# EAGLE schematic Control_Logic_V2 (EAGLE 9.6.2)
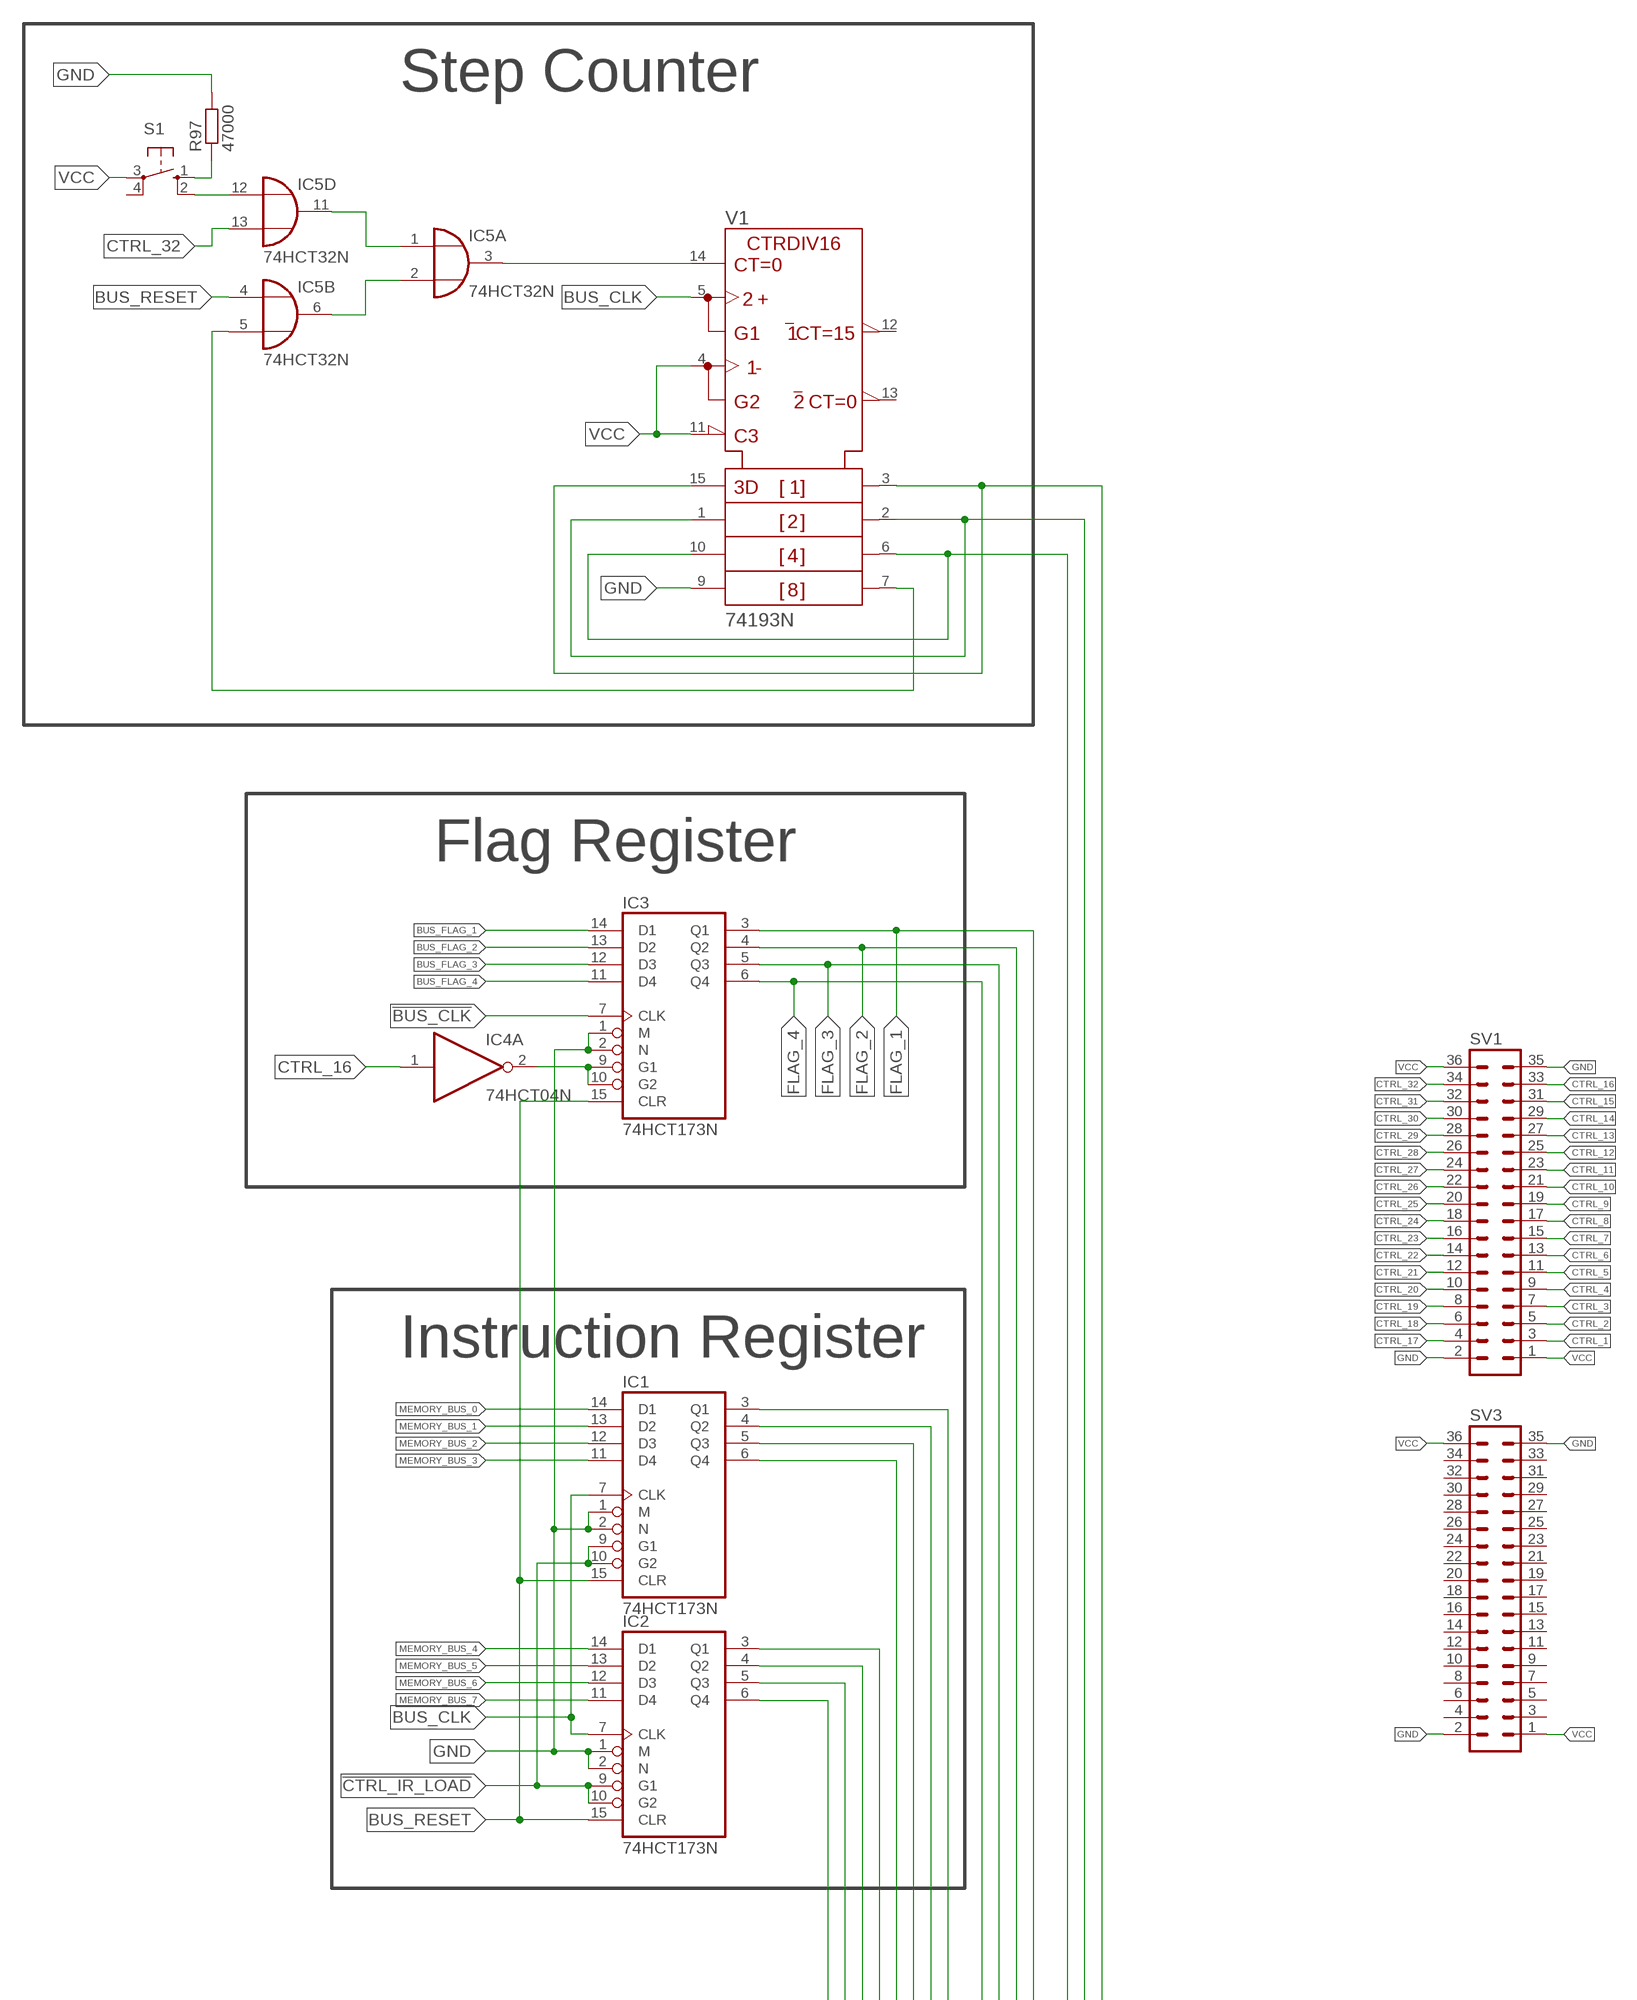
[diagram p0: schematic, sheet 1, part 1 of 3]
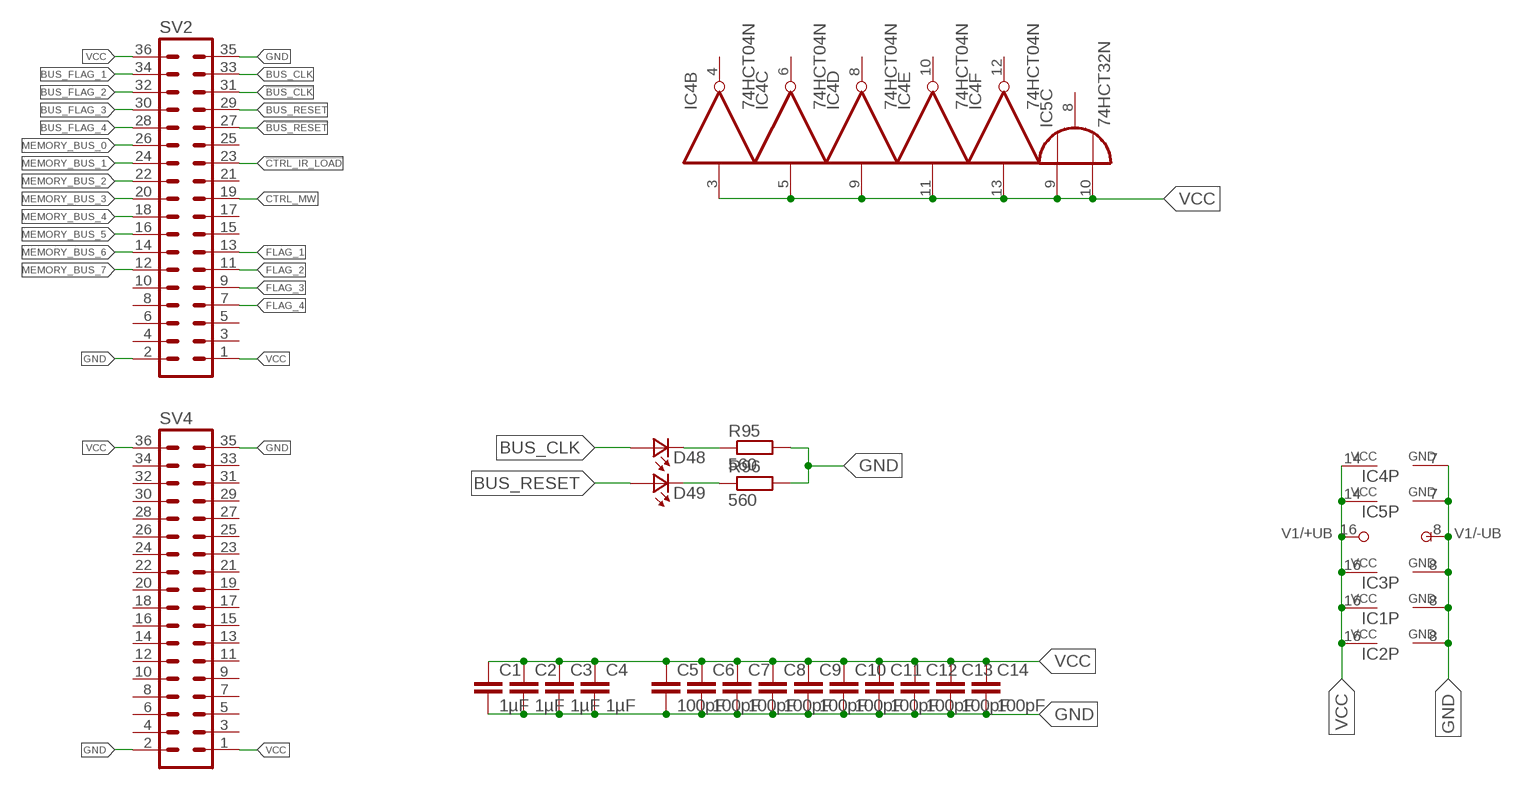
[diagram p1: schematic, sheet 1, part 2 of 3]
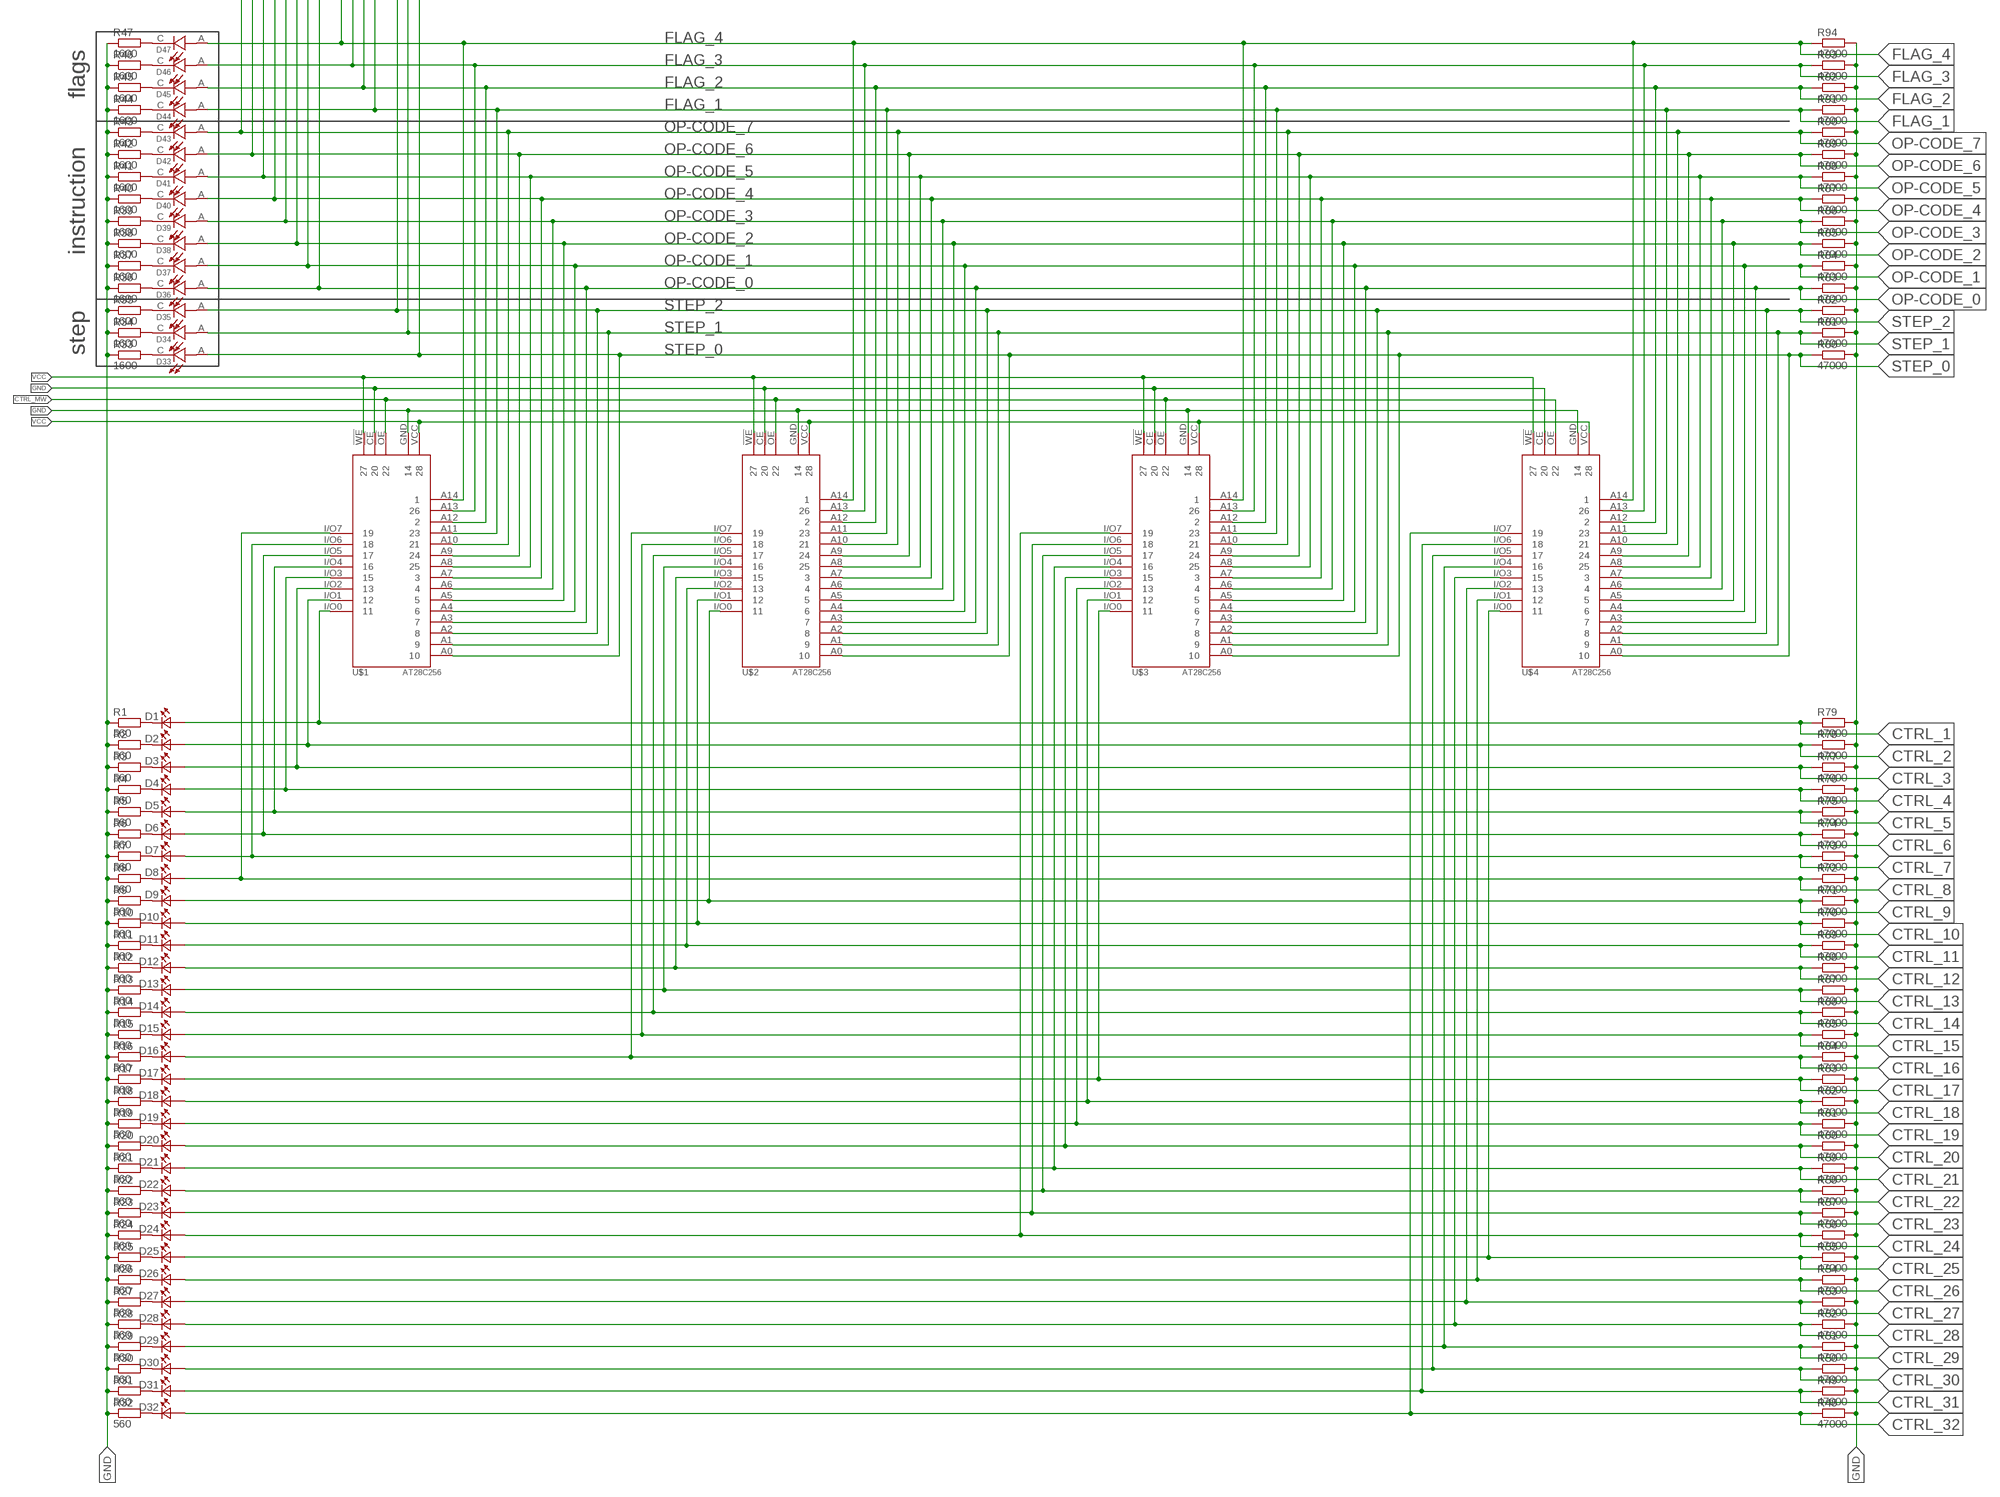
[diagram p2: schematic, sheet 1, part 3 of 3]

## Parts
C1  1µF  C-EUC0805  [C0805]
C2  1µF  C-EUC0805  [C0805]
C3  1µF  C-EUC0805  [C0805]
C4  1µF  C-EUC0805  [C0805]
C5  100pF  C-EUC0805  [C0805]
C6  100pF  C-EUC0805  [C0805]
C7  100pF  C-EUC0805  [C0805]
C8  100pF  C-EUC0805  [C0805]
C9  100pF  C-EUC0805  [C0805]
C10  100pF  C-EUC0805  [C0805]
C11  100pF  C-EUC0805  [C0805]
C12  100pF  C-EUC0805  [C0805]
C13  100pF  C-EUC0805  [C0805]
C14  100pF  C-EUC0805  [C0805]
D1  LTST-C193TBKT-5A  [0603]
D2  LTST-C193TBKT-5A  [0603]
D3  LTST-C193TBKT-5A  [0603]
D4  LTST-C193TBKT-5A  [0603]
D5  LTST-C193TBKT-5A  [0603]
D6  LTST-C193TBKT-5A  [0603]
D7  LTST-C193TBKT-5A  [0603]
D8  LTST-C193TBKT-5A  [0603]
D9  LTST-C193TBKT-5A  [0603]
D10  LTST-C193TBKT-5A  [0603]
D11  LTST-C193TBKT-5A  [0603]
D12  LTST-C193TBKT-5A  [0603]
D13  LTST-C193TBKT-5A  [0603]
D14  LTST-C193TBKT-5A  [0603]
D15  LTST-C193TBKT-5A  [0603]
D16  LTST-C193TBKT-5A  [0603]
D17  LTST-C193TBKT-5A  [0603]
D18  LTST-C193TBKT-5A  [0603]
D19  LTST-C193TBKT-5A  [0603]
D20  LTST-C193TBKT-5A  [0603]
D21  LTST-C193TBKT-5A  [0603]
D22  LTST-C193TBKT-5A  [0603]
D23  LTST-C193TBKT-5A  [0603]
D24  LTST-C193TBKT-5A  [0603]
D25  LTST-C193TBKT-5A  [0603]
D26  LTST-C193TBKT-5A  [0603]
D27  LTST-C193TBKT-5A  [0603]
D28  LTST-C193TBKT-5A  [0603]
D29  LTST-C193TBKT-5A  [0603]
D30  LTST-C193TBKT-5A  [0603]
D31  LTST-C193TBKT-5A  [0603]
D32  LTST-C193TBKT-5A  [0603]
D33  LTST-C193KRKT-5A  [LEDC1608X45N]
D34  LTST-C193KRKT-5A  [LEDC1608X45N]
D35  LTST-C193KRKT-5A  [LEDC1608X45N]
D36  LTST-C193KRKT-5A  [LEDC1608X45N]
D37  LTST-C193KRKT-5A  [LEDC1608X45N]
D38  LTST-C193KRKT-5A  [LEDC1608X45N]
D39  LTST-C193KRKT-5A  [LEDC1608X45N]
D40  LTST-C193KRKT-5A  [LEDC1608X45N]
D41  LTST-C193KRKT-5A  [LEDC1608X45N]
D42  LTST-C193KRKT-5A  [LEDC1608X45N]
D43  LTST-C193KRKT-5A  [LEDC1608X45N]
D44  LTST-C193KRKT-5A  [LEDC1608X45N]
D45  LTST-C193KRKT-5A  [LEDC1608X45N]
D46  LTST-C193KRKT-5A  [LEDC1608X45N]
D47  LTST-C193KRKT-5A  [LEDC1608X45N]
D48  LTST-C193TBKT-5A  [0603]
D49  LTST-C193TBKT-5A  [0603]
IC1  74HCT173N  [DIL16]
IC2  74HCT173N  [DIL16]
IC3  74HCT173N  [DIL16]
IC4  74HCT04N  [DIL14]
IC5  74HCT32N  [DIL14]
R1  560  R-EU_R0805  [R0805]
R2  560  R-EU_R0805  [R0805]
R3  560  R-EU_R0805  [R0805]
R4  560  R-EU_R0805  [R0805]
R5  560  R-EU_R0805  [R0805]
R6  560  R-EU_R0805  [R0805]
R7  560  R-EU_R0805  [R0805]
R8  560  R-EU_R0805  [R0805]
R9  560  R-EU_R0805  [R0805]
R10  560  R-EU_R0805  [R0805]
R11  560  R-EU_R0805  [R0805]
R12  560  R-EU_R0805  [R0805]
R13  560  R-EU_R0805  [R0805]
R14  560  R-EU_R0805  [R0805]
R15  560  R-EU_R0805  [R0805]
R16  560  R-EU_R0805  [R0805]
R17  560  R-EU_R0805  [R0805]
R18  560  R-EU_R0805  [R0805]
R19  560  R-EU_R0805  [R0805]
R20  560  R-EU_R0805  [R0805]
R21  560  R-EU_R0805  [R0805]
R22  560  R-EU_R0805  [R0805]
R23  560  R-EU_R0805  [R0805]
R24  560  R-EU_R0805  [R0805]
R25  560  R-EU_R0805  [R0805]
R26  560  R-EU_R0805  [R0805]
R27  560  R-EU_R0805  [R0805]
R28  560  R-EU_R0805  [R0805]
R29  560  R-EU_R0805  [R0805]
R30  560  R-EU_R0805  [R0805]
R31  560  R-EU_R0805  [R0805]
R32  560  R-EU_R0805  [R0805]
R33  1600  R-EU_R0805  [R0805]
R34  1600  R-EU_R0805  [R0805]
R35  1600  R-EU_R0805  [R0805]
R36  1600  R-EU_R0805  [R0805]
R37  1600  R-EU_R0805  [R0805]
R38  1600  R-EU_R0805  [R0805]
R39  1600  R-EU_R0805  [R0805]
R40  1600  R-EU_R0805  [R0805]
R41  1600  R-EU_R0805  [R0805]
R42  1600  R-EU_R0805  [R0805]
R43  1600  R-EU_R0805  [R0805]
R44  1600  R-EU_R0805  [R0805]
R45  1600  R-EU_R0805  [R0805]
R46  1600  R-EU_R0805  [R0805]
R47  1600  R-EU_R0805  [R0805]
R48  47000  R-EU_R0805  [R0805]
R49  47000  R-EU_R0805  [R0805]
R50  47000  R-EU_R0805  [R0805]
R51  47000  R-EU_R0805  [R0805]
R52  47000  R-EU_R0805  [R0805]
R53  47000  R-EU_R0805  [R0805]
R54  47000  R-EU_R0805  [R0805]
R55  47000  R-EU_R0805  [R0805]
R56  47000  R-EU_R0805  [R0805]
R57  47000  R-EU_R0805  [R0805]
R58  47000  R-EU_R0805  [R0805]
R59  47000  R-EU_R0805  [R0805]
R60  47000  R-EU_R0805  [R0805]
R61  47000  R-EU_R0805  [R0805]
R62  47000  R-EU_R0805  [R0805]
R63  47000  R-EU_R0805  [R0805]
R64  47000  R-EU_R0805  [R0805]
R65  47000  R-EU_R0805  [R0805]
R66  47000  R-EU_R0805  [R0805]
R67  47000  R-EU_R0805  [R0805]
R68  47000  R-EU_R0805  [R0805]
R69  47000  R-EU_R0805  [R0805]
R70  47000  R-EU_R0805  [R0805]
R71  47000  R-EU_R0805  [R0805]
R72  47000  R-EU_R0805  [R0805]
R73  47000  R-EU_R0805  [R0805]
R74  47000  R-EU_R0805  [R0805]
R75  47000  R-EU_R0805  [R0805]
R76  47000  R-EU_R0805  [R0805]
R77  47000  R-EU_R0805  [R0805]
R78  47000  R-EU_R0805  [R0805]
R79  47000  R-EU_R0805  [R0805]
R80  47000  R-EU_R0805  [R0805]
R81  47000  R-EU_R0805  [R0805]
R82  47000  R-EU_R0805  [R0805]
R83  47000  R-EU_R0805  [R0805]
R84  47000  R-EU_R0805  [R0805]
R85  47000  R-EU_R0805  [R0805]
R86  47000  R-EU_R0805  [R0805]
R87  47000  R-EU_R0805  [R0805]
R88  47000  R-EU_R0805  [R0805]
R89  47000  R-EU_R0805  [R0805]
R90  47000  R-EU_R0805  [R0805]
R91  47000  R-EU_R0805  [R0805]
R92  47000  R-EU_R0805  [R0805]
R93  47000  R-EU_R0805  [R0805]
R94  47000  R-EU_R0805  [R0805]
R95  560  R-EU_R0805  [R0805]
R96  560  R-EU_R0805  [R0805]
R97  47000  R-EU_R0805  [R0805]
S1  10-XX  [B3F-10XX]
SV1  MA18-2  [MA18-2]
SV2  MA18-2  [MA18-2]
SV3  MA18-2  [MA18-2]
SV4  MA18-2  [MA18-2]
U$1  AT28C256  [AT28C256]
U$2  AT28C256  [AT28C256]
U$3  AT28C256  [AT28C256]
U$4  AT28C256  [AT28C256]
V1  74193N  [DIL16]

## Nets
!BUS_CLK: IC3.7(CLK) SV2.31
!BUS_RESET: SV2.27
!CTRL_IR_LOAD: IC1.9(G1) IC1.10(G2) IC2.9(G1) IC2.10(G2) SV2.23
BUS_CLK: D48.2(A2) IC1.7(CLK) IC2.7(CLK) SV2.33 V1.5(UP)
BUS_FLAG_1: IC3.14(D1) SV2.34
BUS_FLAG_2: IC3.13(D2) SV2.32
BUS_FLAG_3: IC3.12(D3) SV2.30
BUS_FLAG_4: IC3.11(D4) SV2.28
BUS_RESET: D49.2(A2) IC1.15(CLR) IC2.15(CLR) IC3.15(CLR) IC5.4(B:I0) SV2.29
CTRL_1: D1.2(A2) R79.1 SV1.3 U$1.I/O0
CTRL_2: D2.2(A2) R78.1 SV1.5 U$1.I/O1
CTRL_3: D3.2(A2) R77.1 SV1.7 U$1.I/O2
CTRL_4: D4.2(A2) R76.1 SV1.9 U$1.I/O3
CTRL_5: D5.2(A2) R75.1 SV1.11 U$1.I/O4
CTRL_6: D6.2(A2) R74.1 SV1.13 U$1.I/O5
CTRL_7: D7.2(A2) R73.1 SV1.15 U$1.I/O6
CTRL_8: D8.2(A2) R72.1 SV1.17 U$1.I/O7
CTRL_9: D9.2(A2) R71.1 SV1.19 U$2.I/O0
CTRL_10: D10.2(A2) R70.1 SV1.21 U$2.I/O1
CTRL_11: D11.2(A2) R69.1 SV1.23 U$2.I/O2
CTRL_12: D12.2(A2) R68.1 SV1.25 U$2.I/O3
CTRL_13: D13.2(A2) R67.1 SV1.27 U$2.I/O4
CTRL_14: D14.2(A2) R66.1 SV1.29 U$2.I/O5
CTRL_15: D15.2(A2) R65.1 SV1.31 U$2.I/O6
CTRL_16: D16.2(A2) IC4.1(A:I) R64.1 SV1.33 U$2.I/O7
CTRL_17: D17.2(A2) R63.1 SV1.4 U$3.I/O0
CTRL_18: D18.2(A2) R62.1 SV1.6 U$3.I/O1
CTRL_19: D19.2(A2) R61.1 SV1.8 U$3.I/O2
CTRL_20: D20.2(A2) R60.1 SV1.10 U$3.I/O3
CTRL_21: D21.2(A2) R59.1 SV1.12 U$3.I/O4
CTRL_22: D22.2(A2) R58.1 SV1.14 U$3.I/O5
CTRL_23: D23.2(A2) R57.1 SV1.16 U$3.I/O6
CTRL_24: D24.2(A2) R56.1 SV1.18 U$3.I/O7
CTRL_25: D25.2(A2) R55.1 SV1.20 U$4.I/O0
CTRL_26: D26.2(A2) R54.1 SV1.22 U$4.I/O1
CTRL_27: D27.2(A2) R53.1 SV1.24 U$4.I/O2
CTRL_28: D28.2(A2) R52.1 SV1.26 U$4.I/O3
CTRL_29: D29.2(A2) R51.1 SV1.28 U$4.I/O4
CTRL_30: D30.2(A2) R50.1 SV1.30 U$4.I/O5
CTRL_31: D31.2(A2) R49.1 SV1.32 U$4.I/O6
CTRL_32: D32.2(A2) IC5.13(D:I1) R48.1 SV1.34 U$4.I/O7
CTRL_MW: SV2.19 U$1.!OE U$2.!OE U$3.!OE U$4.!OE
FLAG_1: D44.A IC3.3(Q1) R91.1 SV2.13 U$1.A11 U$2.A11 U$3.A11 U$4.A11
FLAG_2: D45.A IC3.4(Q2) R92.1 SV2.11 U$1.A12 U$2.A12 U$3.A12 U$4.A12
FLAG_3: D46.A IC3.5(Q3) R93.1 SV2.9 U$1.A13 U$2.A13 U$3.A13 U$4.A13
FLAG_4: D47.A IC3.6(Q4) R94.1 SV2.7 U$1.A14 U$2.A14 U$3.A14 U$4.A14
GND: C1.2 C2.2 C3.2 C4.2 C5.2 C6.2 C7.2 C8.2 C9.2 C10.2 C11.2 C12.2 C13.2 C14.2 IC1.1(M) IC1.2(N) IC1.8(GND) IC2.1(M) IC2.2(N) IC2.8(GND) IC3.1(M) IC3.2(N) IC3.8(GND) IC4.7(P:GND) IC5.7(P:GND) R1.1 R2.1 R3.1 R4.1 R5.1 R6.1 R7.1 R8.1 R9.1 R10.1 R11.1 R12.1 R13.1 R14.1 R15.1 R16.1 R17.1 R18.1 R19.1 R20.1 R21.1 R22.1 R23.1 R24.1 R25.1 R26.1 R27.1 R28.1 R29.1 R30.1 R31.1 R32.1 R33.1 R34.1 R35.1 R36.1 R37.1 R38.1 R39.1 R40.1 R41.1 R42.1 R43.1 R44.1 R45.1 R46.1 R47.1 R48.2 R49.2 R50.2 R51.2 R52.2 R53.2 R54.2 R55.2 R56.2 R57.2 R58.2 R59.2 R60.2 R61.2 R62.2 R63.2 R64.2 R65.2 R66.2 R67.2 R68.2 R69.2 R70.2 R71.2 R72.2 R73.2 R74.2 R75.2 R76.2 R77.2 R78.2 R79.2 R80.2 R81.2 R82.2 R83.2 R84.2 R85.2 R86.2 R87.2 R88.2 R89.2 R90.2 R91.2 R92.2 R93.2 R94.2 R95.2 R96.2 R97.2 SV1.2 SV1.35 SV2.2 SV2.35 SV3.2 SV3.35 SV4.2 SV4.35 U$1.!CE U$1.GND U$2.!CE U$2.GND U$3.!CE U$3.GND U$4.!CE U$4.GND V1.8(-UB) V1.9(D)
MEMORY_BUS_0: IC1.14(D1) SV2.26
MEMORY_BUS_1: IC1.13(D2) SV2.24
MEMORY_BUS_2: IC1.12(D3) SV2.22
MEMORY_BUS_3: IC1.11(D4) SV2.20
MEMORY_BUS_4: IC2.14(D1) SV2.18
MEMORY_BUS_5: IC2.13(D2) SV2.16
MEMORY_BUS_6: IC2.12(D3) SV2.14
MEMORY_BUS_7: IC2.11(D4) SV2.12
N$1: IC3.9(G1) IC3.10(G2) IC4.2(A:O)
N$2: IC5.1(A:I0) IC5.11(D:O)
N$3: IC5.2(A:I1) IC5.6(B:O)
N$4: IC5.3(A:O) V1.14(CLR)
N$5: IC5.12(D:I0) S1.2(S1)
N$6: R97.1 S1.1(S)
N$7: IC5.5(B:I1) V1.7(QD)
N$8: D48.1(K2) R95.1
N$9: D49.1(K2) R96.1
N$32: D1.1(K2) R1.2
N$33: D2.1(K2) R2.2
N$34: D3.1(K2) R3.2
N$35: D4.1(K2) R4.2
N$36: D5.1(K2) R5.2
N$37: D6.1(K2) R6.2
N$38: D7.1(K2) R7.2
N$39: D8.1(K2) R8.2
N$40: D9.1(K2) R9.2
N$41: D10.1(K2) R10.2
N$42: D11.1(K2) R11.2
N$43: D12.1(K2) R12.2
N$44: D13.1(K2) R13.2
N$45: D14.1(K2) R14.2
N$46: D15.1(K2) R15.2
N$47: D16.1(K2) R16.2
N$48: D17.1(K2) R17.2
N$49: D18.1(K2) R18.2
N$50: D19.1(K2) R19.2
N$51: D20.1(K2) R20.2
N$52: D21.1(K2) R21.2
N$53: D22.1(K2) R22.2
N$54: D23.1(K2) R23.2
N$55: D24.1(K2) R24.2
N$56: D25.1(K2) R25.2
N$57: D26.1(K2) R26.2
N$58: D27.1(K2) R27.2
N$59: D28.1(K2) R28.2
N$60: D29.1(K2) R29.2
N$61: D30.1(K2) R30.2
N$62: D31.1(K2) R31.2
N$63: D32.1(K2) R32.2
N$64: D33.C R33.2
N$65: D34.C R34.2
N$66: D35.C R35.2
N$67: D36.C R36.2
N$68: D37.C R37.2
N$69: D38.C R38.2
N$70: D39.C R39.2
N$71: D40.C R40.2
N$72: D41.C R41.2
N$73: D42.C R42.2
N$74: D43.C R43.2
N$75: D44.C R44.2
N$76: D45.C R45.2
N$93: D46.C R46.2
N$94: D47.C R47.2
OP-CODE_0: D36.A IC1.3(Q1) R83.1 U$1.A3 U$2.A3 U$3.A3 U$4.A3
OP-CODE_1: D37.A IC1.4(Q2) R84.1 U$1.A4 U$2.A4 U$3.A4 U$4.A4
OP-CODE_2: D38.A IC1.5(Q3) R85.1 U$1.A5 U$2.A5 U$3.A5 U$4.A5
OP-CODE_3: D39.A IC1.6(Q4) R86.1 U$1.A6 U$2.A6 U$3.A6 U$4.A6
OP-CODE_4: D40.A IC2.3(Q1) R87.1 U$1.A7 U$2.A7 U$3.A7 U$4.A7
OP-CODE_5: D41.A IC2.4(Q2) R88.1 U$1.A8 U$2.A8 U$3.A8 U$4.A8
OP-CODE_6: D42.A IC2.5(Q3) R89.1 U$1.A9 U$2.A9 U$3.A9 U$4.A9
OP-CODE_7: D43.A IC2.6(Q4) R90.1 U$1.A10 U$2.A10 U$3.A10 U$4.A10
STEP_0: D33.A R80.1 U$1.A0 U$2.A0 U$3.A0 U$4.A0 V1.3(QA) V1.15(A)
STEP_1: D34.A R81.1 U$1.A1 U$2.A1 U$3.A1 U$4.A1 V1.1(B) V1.2(QB)
STEP_2: D35.A R82.1 U$1.A2 U$2.A2 U$3.A2 U$4.A2 V1.6(QC) V1.10(C)
VCC: C1.1 C2.1 C3.1 C4.1 C5.1 C6.1 C7.1 C8.1 C9.1 C10.1 C11.1 C12.1 C13.1 C14.1 IC1.16(VCC) IC2.16(VCC) IC3.16(VCC) IC4.3(B:I) IC4.5(C:I) IC4.9(D:I) IC4.11(E:I) IC4.13(F:I) IC4.14(P:VCC) IC5.9(C:I0) IC5.10(C:I1) IC5.14(P:VCC) S1.3(P) SV1.1 SV1.36 SV2.1 SV2.36 SV3.1 SV3.36 SV4.1 SV4.36 U$1.!WE U$1.VCC U$2.!WE U$2.VCC U$3.!WE U$3.VCC U$4.!WE U$4.VCC V1.4(DOWN) V1.11(!LOAD) V1.16(+UB)
Unconnected: IC4.4(B:O) IC4.6(C:O) IC4.8(D:O) IC4.10(E:O) IC4.12(F:O) IC5.8(C:O) S1.4(P1) SV2.3 SV2.4 SV2.5 SV2.6 SV2.8 SV2.10 SV2.15 SV2.17 SV2.21 SV2.25 SV3.3 SV3.4 SV3.5 SV3.6 SV3.7 SV3.8 SV3.9 SV3.10 SV3.11 SV3.12 SV3.13 SV3.14 SV3.15 SV3.16 SV3.17 SV3.18 SV3.19 SV3.20 SV3.21 SV3.22 SV3.23 SV3.24 SV3.25 SV3.26 SV3.27 SV3.28 SV3.29 SV3.30 SV3.31 SV3.32 SV3.33 SV3.34 SV4.3 SV4.4 SV4.5 SV4.6 SV4.7 SV4.8 SV4.9 SV4.10 SV4.11 SV4.12 SV4.13 SV4.14 SV4.15 SV4.16 SV4.17 SV4.18 SV4.19 SV4.20 SV4.21 SV4.22 SV4.23 SV4.24 SV4.25 SV4.26 SV4.27 SV4.28 SV4.29 SV4.30 SV4.31 SV4.32 SV4.33 SV4.34 V1.12(!CO) V1.13(!BO)

## Notes on the sheet
- Step Counter
- Flag Register
- Instruction Register
- flags
- instruction
- step

## Library data of the parts
C1-C14 = rcl:C-EU: CAPACITOR, European symbol; SPICEPREFIX: C
D1-D32 D48 D49 = Dargon's_lib:LTST-C193TBKT-5A: http://octopart.com/ltst-c190tbkt-lite-on-550003
D33-D47 = Dargon's_lib:LTST-C193KRKT-5A: Red 631nm LED Indication - Discrete 2V 0603 (1608 Metric); MANUFACTURER: Lite-On; MAXIMUM_PACKAGE_HEIGHT: 0.45 mm; PARTREV: C; STANDARD: IPC 7351B
IC1-IC3 = 74xx-eu:74*173: 4-bit D type REGISTER, 3-state
IC4 = 74xx-eu:74*04: Hex INVERTER
IC5 = 74xx-eu:74*32: Quad 2-input OR gate
R1-R97 = rcl:R-EU_: RESISTOR, European symbol; SPICEPREFIX: R
S1 = switch-omron:10-XX: OMRON SWITCH; MPN: B3F-1000; OC_FARNELL: 176432; OC_NEWARK: 36M3542
SV1-SV4 = con-lstb:MA18-2: PIN HEADER; OC_FARNELL: unknown; OC_NEWARK: unknown
U$1-U$4 = Dargon's_lib:AT28C256
V1 = 74ttl-din:74*193: Synchronus 4-bit up down COUNTER